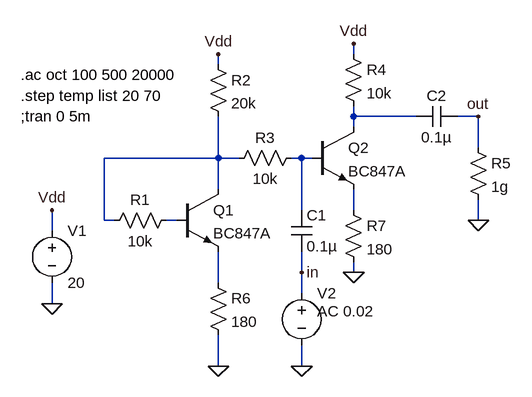
[diagram p0: schematic bjt-amplifier-3.asc]
bjt-amplifier-3.asc, the LTspice schematic file:
Version 4
SHEET 1 880 680
WIRE -336 -352 -336 -368
WIRE -544 -336 -544 -352
WIRE -336 -256 -336 -272
WIRE -240 -256 -336 -256
WIRE -144 -256 -176 -256
WIRE -336 -240 -336 -256
WIRE -144 -208 -144 -256
WIRE -544 -192 -544 -256
WIRE -544 -192 -720 -192
WIRE -512 -192 -544 -192
WIRE -416 -192 -432 -192
WIRE -400 -192 -416 -192
WIRE -544 -144 -544 -192
WIRE -416 -112 -416 -192
WIRE -336 -112 -336 -144
WIRE -720 -96 -720 -192
WIRE -704 -96 -720 -96
WIRE -608 -96 -624 -96
WIRE -144 -96 -144 -128
WIRE -800 -80 -800 -112
WIRE -416 -16 -416 -48
WIRE -336 -16 -336 -32
WIRE -544 0 -544 -48
WIRE -416 16 -416 -16
WIRE -800 32 -800 0
WIRE -544 128 -544 80
WIRE -416 128 -416 96
FLAG -800 32 0
FLAG -800 -112 Vdd
FLAG -416 128 0
FLAG -144 -96 0
FLAG -144 -256 out
FLAG -416 -16 in
FLAG -544 -352 Vdd
FLAG -544 128 0
FLAG -336 -16 0
FLAG -336 -368 Vdd
SYMBOL voltage -800 -96 R0
WINDOW 123 0 0 Left 2
WINDOW 39 0 0 Left 2
SYMATTR InstName V1
SYMATTR Value 20
SYMBOL npn -608 -144 R0
SYMATTR InstName Q1
SYMATTR Value BC847A
SYMBOL cap -432 -112 R0
SYMATTR InstName C1
SYMATTR Value 0.1µ
SYMBOL voltage -416 0 R0
WINDOW 39 0 0 Left 2
WINDOW 3 24 72 Invisible 2
WINDOW 123 24 44 Left 2
SYMATTR Value SINE(0 0.02 1000)
SYMATTR Value2 AC 0.02
SYMATTR InstName V2
SYMBOL cap -176 -272 R90
WINDOW 0 0 32 VBottom 2
WINDOW 3 32 32 VTop 2
SYMATTR InstName C2
SYMATTR Value 0.1µ
SYMBOL res -160 -224 R0
SYMATTR InstName R5
SYMATTR Value 1g
SYMBOL npn -400 -240 R0
SYMATTR InstName Q2
SYMATTR Value BC847A
SYMBOL res -608 -112 R90
WINDOW 0 0 56 VBottom 2
WINDOW 3 32 56 VTop 2
SYMATTR InstName R1
SYMATTR Value 10k
SYMBOL res -560 -352 R0
SYMATTR InstName R2
SYMATTR Value 20k
SYMBOL res -416 -208 R90
WINDOW 0 0 56 VBottom 2
WINDOW 3 32 56 VTop 2
SYMATTR InstName R3
SYMATTR Value 10k
SYMBOL res -352 -368 R0
SYMATTR InstName R4
SYMATTR Value 10k
SYMBOL res -560 -16 R0
SYMATTR InstName R6
SYMATTR Value 180
SYMBOL res -352 -128 R0
SYMATTR InstName R7
SYMATTR Value 180
TEXT -848 -320 Left 2 !.ac oct 100 500 20000
TEXT -848 -288 Left 2 !.step temp list 20 70
TEXT -848 -256 Left 2 !;tran 0 5m

The netlist it stands for:
* bjt-amplifier-3.asc
V1 Vdd 0 20
Q1 N002 N005 N006 0 BC847A
C1 N003 in 0.1µ
V2 in 0 SINE(0 0.02 1000) AC 0.02
C2 out N001 0.1µ
R5 out 0 1g
Q2 N001 N003 N004 0 BC847A
R1 N005 N002 10k
R2 Vdd N002 20k
R3 N003 N002 10k
R4 Vdd N001 10k
R6 N006 0 180
R7 N004 0 180
.model NPN NPN
.model PNP PNP
.lib standard.bjt
.ac oct 100 500 20000
.step temp list 20 70
;tran 0 5m
.backanno
.end